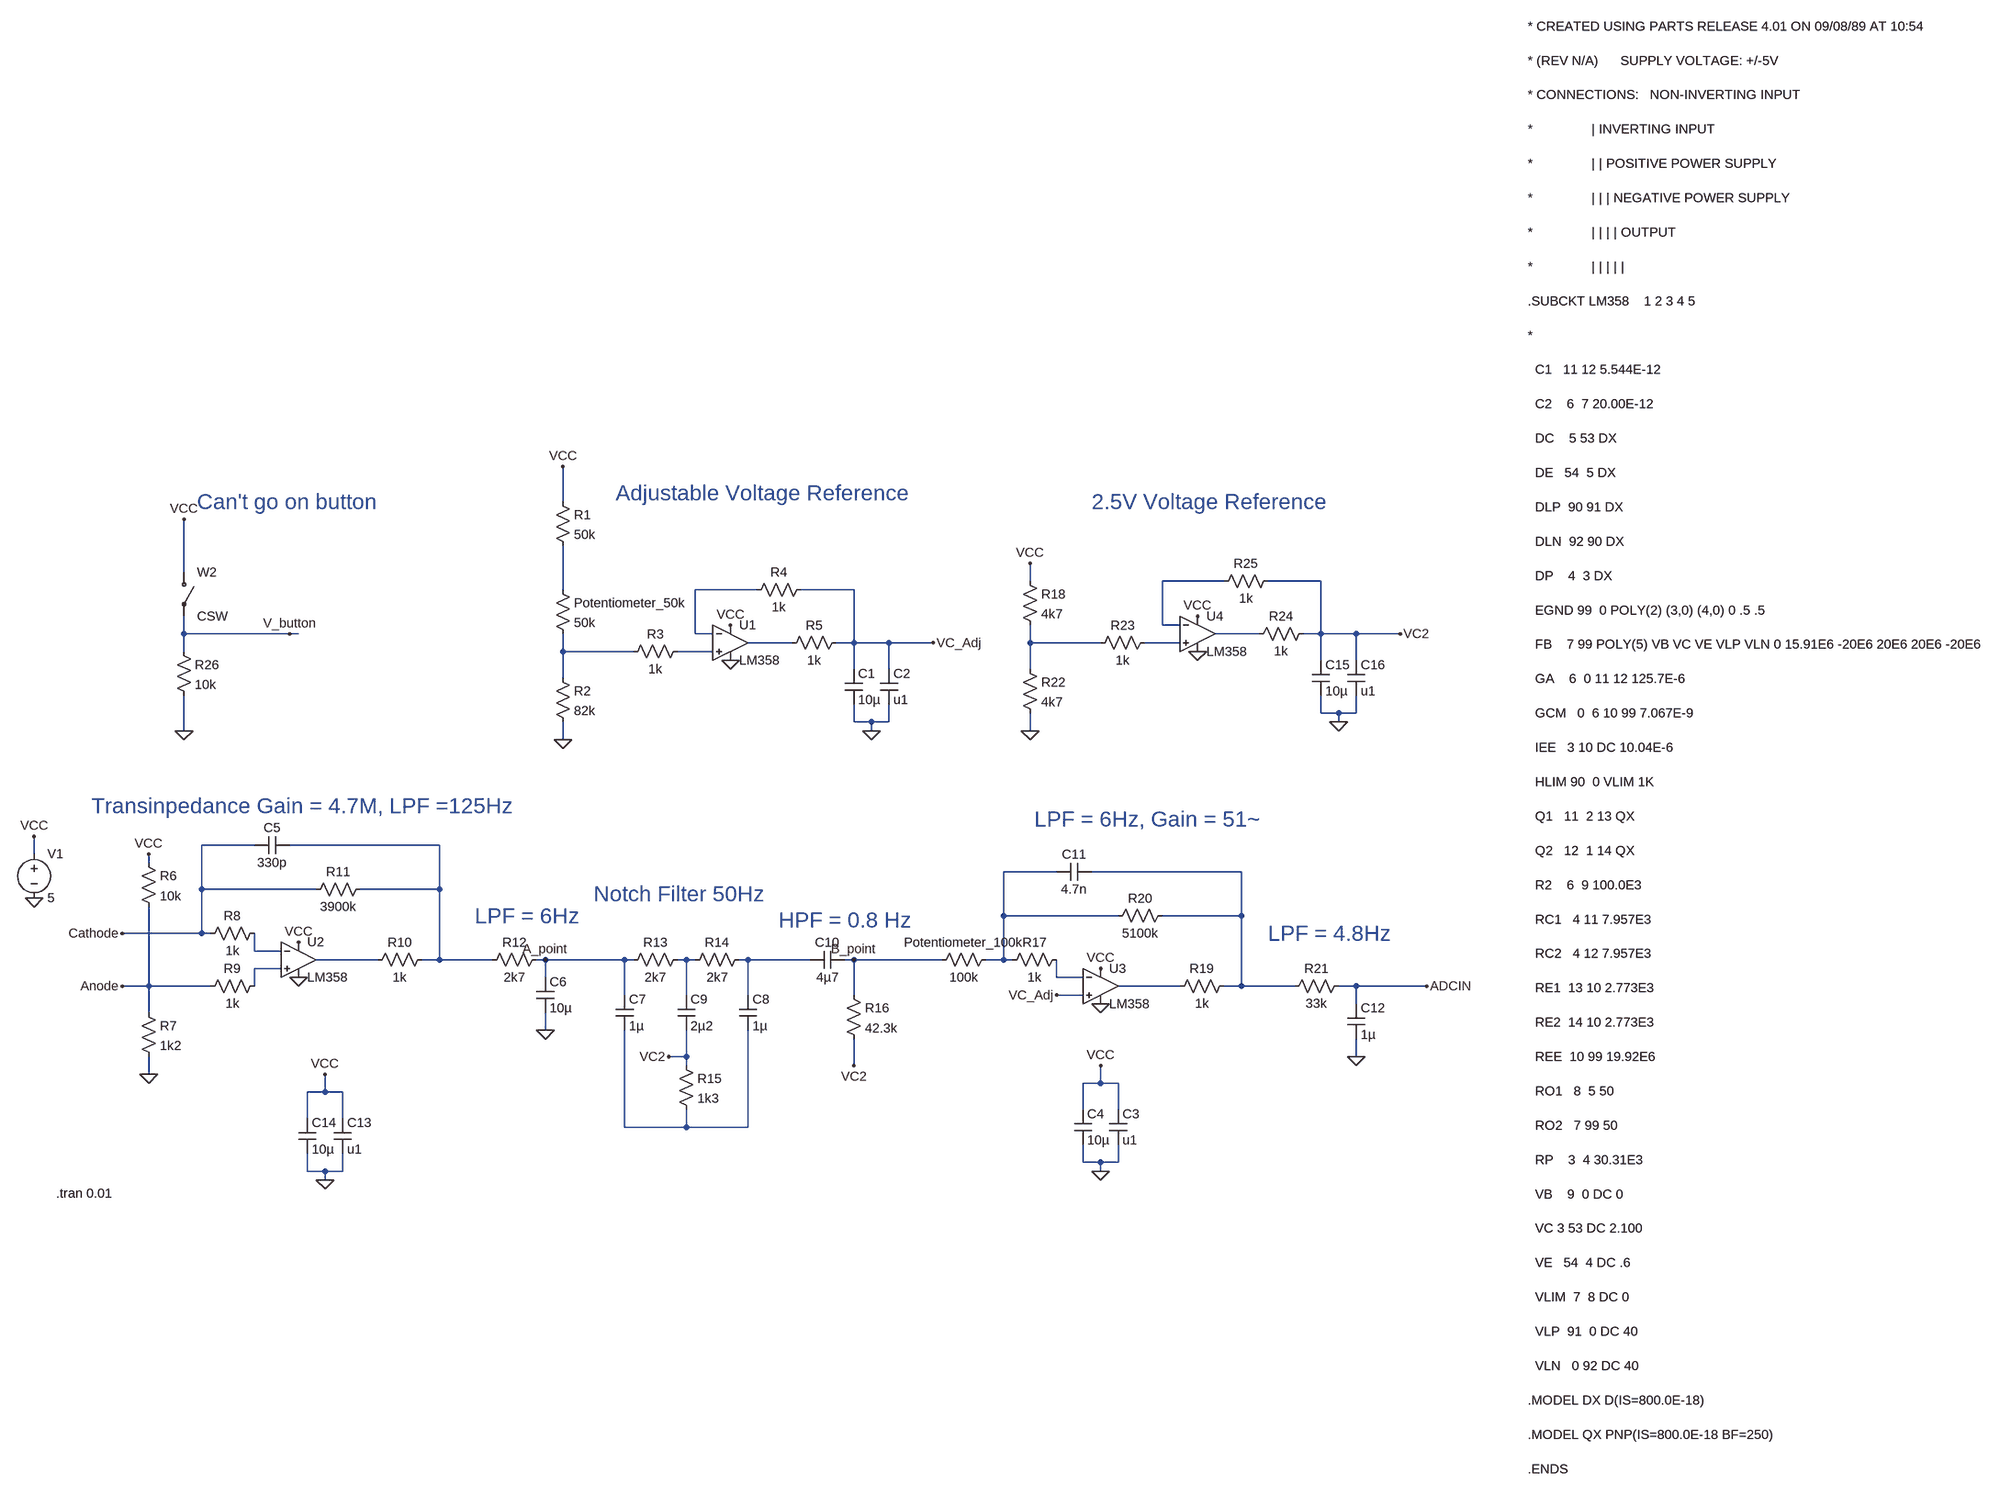
[diagram p0: schematic Analog_Front_End_to_PCB.asc]
Analog_Front_End_to_PCB.asc, the LTspice schematic file:
Version 4
SHEET 1 4952 896
WIRE 1728 -608 1728 -672
WIRE 1040 -480 1040 -576
WIRE 2576 -464 2576 -496
WIRE 2928 -464 2816 -464
WIRE 3104 -464 3008 -464
WIRE 1728 -448 1728 -528
WIRE 2080 -448 1968 -448
WIRE 2256 -448 2160 -448
WIRE 2816 -384 2816 -464
WIRE 2848 -384 2816 -384
WIRE 1040 -368 1040 -400
WIRE 1232 -368 1040 -368
WIRE 1248 -368 1232 -368
WIRE 1968 -368 1968 -448
WIRE 2000 -368 1968 -368
WIRE 2992 -368 2912 -368
WIRE 3104 -368 3104 -464
WIRE 3104 -368 3072 -368
WIRE 3168 -368 3104 -368
WIRE 3248 -368 3168 -368
WIRE 2144 -352 2064 -352
WIRE 2256 -352 2256 -448
WIRE 2256 -352 2224 -352
WIRE 2320 -352 2256 -352
WIRE 2400 -352 2320 -352
WIRE 2576 -352 2576 -384
WIRE 2704 -352 2576 -352
WIRE 2848 -352 2784 -352
WIRE 1040 -336 1040 -368
WIRE 1728 -336 1728 -368
WIRE 1856 -336 1728 -336
WIRE 2000 -336 1936 -336
WIRE 3104 -320 3104 -368
WIRE 3168 -320 3168 -368
WIRE 2256 -304 2256 -352
WIRE 2320 -304 2320 -352
WIRE 2576 -304 2576 -352
WIRE 1728 -288 1728 -336
WIRE 3104 -224 3104 -256
WIRE 3136 -224 3104 -224
WIRE 3168 -224 3168 -256
WIRE 3168 -224 3136 -224
WIRE 2256 -208 2256 -240
WIRE 2288 -208 2256 -208
WIRE 2320 -208 2320 -240
WIRE 2320 -208 2288 -208
WIRE 3136 -208 3136 -224
WIRE 1040 -192 1040 -256
WIRE 2288 -192 2288 -208
WIRE 2576 -192 2576 -224
WIRE 1728 -176 1728 -208
WIRE 1168 16 1072 16
WIRE 1504 16 1232 16
WIRE 768 32 768 0
WIRE 976 48 976 32
WIRE 2624 64 2528 64
WIRE 2960 64 2688 64
WIRE 1072 96 1072 16
WIRE 1280 96 1072 96
WIRE 1504 96 1504 16
WIRE 1504 96 1360 96
WIRE 2528 144 2528 64
WIRE 2736 144 2528 144
WIRE 2960 144 2960 64
WIRE 2960 144 2816 144
WIRE 1072 176 1072 96
WIRE 1072 176 928 176
WIRE 1088 176 1072 176
WIRE 1168 208 1168 176
WIRE 1216 208 1168 208
WIRE 1392 224 1280 224
WIRE 1504 224 1504 96
WIRE 1504 224 1472 224
WIRE 1600 224 1504 224
WIRE 1696 224 1680 224
WIRE 1840 224 1696 224
WIRE 1856 224 1840 224
WIRE 1952 224 1936 224
WIRE 1968 224 1952 224
WIRE 2064 224 2048 224
WIRE 2176 224 2064 224
WIRE 2256 224 2240 224
WIRE 2416 224 2256 224
WIRE 2528 224 2528 144
WIRE 2528 224 2496 224
WIRE 2544 224 2528 224
WIRE 1216 240 1168 240
WIRE 1696 256 1696 224
WIRE 2624 256 2624 224
WIRE 2672 256 2624 256
WIRE 976 272 976 128
WIRE 976 272 928 272
WIRE 1088 272 976 272
WIRE 1168 272 1168 240
WIRE 2848 272 2736 272
WIRE 2960 272 2960 144
WIRE 2960 272 2928 272
WIRE 3056 272 2960 272
WIRE 3168 272 3136 272
WIRE 3296 272 3168 272
WIRE 1840 288 1840 224
WIRE 1952 288 1952 224
WIRE 2064 288 2064 224
WIRE 2256 288 2256 224
WIRE 2672 288 2624 288
WIRE 3168 304 3168 272
WIRE 976 320 976 272
WIRE 1696 352 1696 320
WIRE 1952 400 1952 352
WIRE 1952 400 1920 400
WIRE 3168 400 3168 368
WIRE 1952 416 1952 400
WIRE 2256 416 2256 368
WIRE 976 432 976 400
WIRE 2704 448 2704 416
WIRE 2704 448 2672 448
WIRE 2736 448 2704 448
WIRE 1296 464 1296 432
WIRE 1296 464 1264 464
WIRE 1328 464 1296 464
WIRE 2672 496 2672 448
WIRE 2736 496 2736 448
WIRE 1264 512 1264 464
WIRE 1328 512 1328 464
WIRE 1840 528 1840 352
WIRE 1952 528 1952 496
WIRE 1952 528 1840 528
WIRE 2064 528 2064 352
WIRE 2064 528 1952 528
WIRE 2672 592 2672 560
WIRE 2704 592 2672 592
WIRE 2736 592 2736 560
WIRE 2736 592 2704 592
WIRE 1264 608 1264 576
WIRE 1296 608 1264 608
WIRE 1328 608 1328 576
WIRE 1328 608 1296 608
WIRE 2704 608 2704 592
WIRE 1296 624 1296 608
FLAG 1728 -176 0
FLAG 1728 -672 VCC
FLAG 2288 -192 0
FLAG 2032 -320 0
FLAG 2032 -384 VCC
FLAG 2400 -352 VC_Adj
FLAG 768 112 0
FLAG 768 0 VCC
FLAG 2704 608 0
FLAG 2704 416 VCC
FLAG 976 32 VCC
FLAG 976 432 0
FLAG 928 272 Anode
FLAG 928 176 Cathode
FLAG 1248 256 0
FLAG 1248 192 VCC
FLAG 1696 352 0
FLAG 1920 400 VC2
FLAG 2256 416 VC2
FLAG 2704 304 0
FLAG 2704 240 VCC
FLAG 2624 288 VC_Adj
FLAG 3168 400 0
FLAG 3296 272 ADCIN
FLAG 1296 624 0
FLAG 1296 432 VCC
FLAG 2576 -192 0
FLAG 2576 -496 VCC
FLAG 3136 -208 0
FLAG 2880 -336 0
FLAG 2880 -400 VCC
FLAG 3248 -368 VC2
FLAG 1696 224 A_point
FLAG 2256 224 B_point
FLAG 1040 -192 0
FLAG 1040 -576 VCC
FLAG 1232 -368 V_button
SYMBOL res 1712 -464 R0
SYMATTR InstName Potentiometer_50k
SYMATTR Value 50k
SYMBOL res 1712 -304 R0
SYMATTR InstName R2
SYMATTR Value 82k
SYMBOL res 1952 -352 R90
WINDOW 0 0 56 VBottom 2
WINDOW 3 32 56 VTop 2
SYMATTR InstName R3
SYMATTR Value 1k
SYMBOL Opamps\\opamp2 2032 -416 R0
SYMATTR InstName U1
SYMATTR Value LM358
SYMBOL res 2240 -368 R90
WINDOW 0 0 56 VBottom 2
WINDOW 3 32 56 VTop 2
SYMATTR InstName R5
SYMATTR Value 1k
SYMBOL res 2176 -464 R90
WINDOW 0 0 56 VBottom 2
WINDOW 3 32 56 VTop 2
SYMATTR InstName R4
SYMATTR Value 1k
SYMBOL cap 2240 -304 R0
SYMATTR InstName C1
SYMATTR Value 10µ
SYMBOL cap 2304 -304 R0
SYMATTR InstName C2
SYMATTR Value u1
SYMBOL voltage 768 16 R0
WINDOW 123 0 0 Left 2
WINDOW 39 0 0 Left 2
SYMATTR InstName V1
SYMATTR Value 5
SYMBOL cap 2720 496 R0
SYMATTR InstName C3
SYMATTR Value u1
SYMBOL cap 2656 496 R0
SYMATTR InstName C4
SYMATTR Value 10µ
SYMBOL Opamps\\opamp2 1248 160 R0
SYMATTR InstName U2
SYMATTR Value LM358
SYMBOL res 960 32 R0
SYMATTR InstName R6
SYMATTR Value 10k
SYMBOL res 960 304 R0
SYMATTR InstName R7
SYMATTR Value 1k2
SYMBOL res 1184 160 R90
WINDOW 0 0 56 VBottom 2
WINDOW 3 32 56 VTop 2
SYMATTR InstName R8
SYMATTR Value 1k
SYMBOL res 1184 256 R90
WINDOW 0 0 56 VBottom 2
WINDOW 3 32 56 VTop 2
SYMATTR InstName R9
SYMATTR Value 1k
SYMBOL res 1488 208 R90
WINDOW 0 0 56 VBottom 2
WINDOW 3 32 56 VTop 2
SYMATTR InstName R10
SYMATTR Value 1k
SYMBOL res 1376 80 R90
WINDOW 0 0 56 VBottom 2
WINDOW 3 32 56 VTop 2
SYMATTR InstName R11
SYMATTR Value 3900k
SYMBOL cap 1232 0 R90
WINDOW 0 0 32 VBottom 2
WINDOW 3 32 32 VTop 2
SYMATTR InstName C5
SYMATTR Value 330p
SYMBOL res 1696 208 R90
WINDOW 0 0 56 VBottom 2
WINDOW 3 32 56 VTop 2
SYMATTR InstName R12
SYMATTR Value 2k7
SYMBOL cap 1680 256 R0
SYMATTR InstName C6
SYMATTR Value 10µ
SYMBOL res 1952 208 R90
WINDOW 0 0 56 VBottom 2
WINDOW 3 32 56 VTop 2
SYMATTR InstName R13
SYMATTR Value 2k7
SYMBOL res 2064 208 R90
WINDOW 0 0 56 VBottom 2
WINDOW 3 32 56 VTop 2
SYMATTR InstName R14
SYMATTR Value 2k7
SYMBOL cap 1824 288 R0
SYMATTR InstName C7
SYMATTR Value 1µ
SYMBOL cap 2048 288 R0
SYMATTR InstName C8
SYMATTR Value 1µ
SYMBOL cap 1936 288 R0
SYMATTR InstName C9
SYMATTR Value 2µ2
SYMBOL res 1936 400 R0
SYMATTR InstName R15
SYMATTR Value 1k3
SYMBOL cap 2240 208 R90
WINDOW 0 0 32 VBottom 2
WINDOW 3 32 32 VTop 2
SYMATTR InstName C10
SYMATTR Value 4µ7
SYMBOL res 2240 272 R0
SYMATTR InstName R16
SYMATTR Value 42.3k
SYMBOL Opamps\\opamp2 2704 208 R0
SYMATTR InstName U3
SYMATTR Value LM358
SYMBOL res 2640 208 R90
WINDOW 0 0 56 VBottom 2
WINDOW 3 32 56 VTop 2
SYMATTR InstName R17
SYMATTR Value 1k
SYMBOL res 2944 256 R90
WINDOW 0 0 56 VBottom 2
WINDOW 3 32 56 VTop 2
SYMATTR InstName R19
SYMATTR Value 1k
SYMBOL res 2832 128 R90
WINDOW 0 0 56 VBottom 2
WINDOW 3 32 56 VTop 2
SYMATTR InstName R20
SYMATTR Value 5100k
SYMBOL cap 2688 48 R90
WINDOW 0 0 32 VBottom 2
WINDOW 3 32 32 VTop 2
SYMATTR InstName C11
SYMATTR Value 4.7n
SYMBOL res 2512 208 R90
WINDOW 0 0 56 VBottom 2
WINDOW 3 32 56 VTop 2
SYMATTR InstName Potentiometer_100k
SYMATTR Value 100k
SYMBOL res 3152 256 R90
WINDOW 0 0 56 VBottom 2
WINDOW 3 32 56 VTop 2
SYMATTR InstName R21
SYMATTR Value 33k
SYMBOL cap 3152 304 R0
SYMATTR InstName C12
SYMATTR Value 1µ
SYMBOL cap 1312 512 R0
SYMATTR InstName C13
SYMATTR Value u1
SYMBOL cap 1248 512 R0
SYMATTR InstName C14
SYMATTR Value 10µ
SYMBOL res 2560 -480 R0
SYMATTR InstName R18
SYMATTR Value 4k7
SYMBOL res 2560 -320 R0
SYMATTR InstName R22
SYMATTR Value 4k7
SYMBOL res 2800 -368 R90
WINDOW 0 0 56 VBottom 2
WINDOW 3 32 56 VTop 2
SYMATTR InstName R23
SYMATTR Value 1k
SYMBOL Opamps\\opamp2 2880 -432 R0
SYMATTR InstName U4
SYMATTR Value LM358
SYMBOL res 3088 -384 R90
WINDOW 0 0 56 VBottom 2
WINDOW 3 32 56 VTop 2
SYMATTR InstName R24
SYMATTR Value 1k
SYMBOL res 3024 -480 R90
WINDOW 0 0 56 VBottom 2
WINDOW 3 32 56 VTop 2
SYMATTR InstName R25
SYMATTR Value 1k
SYMBOL cap 3088 -320 R0
SYMATTR InstName C15
SYMATTR Value 10µ
SYMBOL cap 3152 -320 R0
SYMATTR InstName C16
SYMATTR Value u1
SYMBOL res 1712 -624 R0
SYMATTR InstName R1
SYMATTR Value 50k
SYMBOL res 1024 -352 R0
SYMATTR InstName R26
SYMATTR Value 10k
SYMBOL csw 1040 -480 R0
SYMATTR InstName W2
TEXT 808 648 Left 2 !.tran 0.01
TEXT 2688 -608 Left 4 ;2.5V Voltage Reference
TEXT 1824 -624 Left 4 ;Adjustable Voltage Reference
TEXT 872 -56 Left 4 ;Transinpedance Gain = 4.7M, LPF =125Hz
TEXT 1784 104 Left 4 ;Notch Filter 50Hz
TEXT 2120 152 Left 4 ;HPF = 0.8 Hz
TEXT 2584 -32 Left 4 ;LPF = 6Hz, Gain = 51~
TEXT 3008 176 Left 4 ;LPF = 4.8Hz
TEXT 1568 144 Left 4 ;LPF = 6Hz
TEXT 1064 -608 Left 4 ;Can't go on button
TEXT 4016 -1472 Left 2 !* CREATED USING PARTS RELEASE 4.01 ON 09/08/89 AT 10:54\n \n* (REV N/A)      SUPPLY VOLTAGE: +/-5V\n \n* CONNECTIONS:   NON-INVERTING INPUT\n \n*                | INVERTING INPUT\n \n*                | | POSITIVE POWER SUPPLY\n \n*                | | | NEGATIVE POWER SUPPLY\n \n*                | | | | OUTPUT\n \n*                | | | | |\n \n.SUBCKT LM358    1 2 3 4 5\n \n*\n \n  C1   11 12 5.544E-12\n \n  C2    6  7 20.00E-12\n \n  DC    5 53 DX\n \n  DE   54  5 DX\n \n  DLP  90 91 DX\n \n  DLN  92 90 DX\n \n  DP    4  3 DX\n \n  EGND 99  0 POLY(2) (3,0) (4,0) 0 .5 .5\n \n  FB    7 99 POLY(5) VB VC VE VLP VLN 0 15.91E6 -20E6 20E6 20E6 -20E6\n \n  GA    6  0 11 12 125.7E-6\n \n  GCM   0  6 10 99 7.067E-9\n \n  IEE   3 10 DC 10.04E-6\n \n  HLIM 90  0 VLIM 1K\n \n  Q1   11  2 13 QX\n \n  Q2   12  1 14 QX\n \n  R2    6  9 100.0E3\n \n  RC1   4 11 7.957E3\n \n  RC2   4 12 7.957E3\n \n  RE1  13 10 2.773E3\n \n  RE2  14 10 2.773E3\n \n  REE  10 99 19.92E6\n \n  RO1   8  5 50\n \n  RO2   7 99 50\n \n  RP    3  4 30.31E3\n \n  VB    9  0 DC 0\n \n  VC 3 53 DC 2.100\n \n  VE   54  4 DC .6\n \n  VLIM  7  8 DC 0\n \n  VLP  91  0 DC 40\n \n  VLN   0 92 DC 40\n \n.MODEL DX D(IS=800.0E-18)\n \n.MODEL QX PNP(IS=800.0E-18 BF=250)\n \n.ENDS

The netlist it stands for:
* Analog_Front_End_to_PCB.asc
R§Potentiometer_50k N002 N008 50k
R2 N008 0 82k
R3 N009 N008 1k
XU1 N009 N003 VCC 0 N005 LM358  ; pins In+ In- V+ V- OUT
R5 VC_Adj N005 1k
R4 VC_Adj N003 1k
C1 VC_Adj 0 10µ
C2 VC_Adj 0 u1
V1 VCC 0 5
C3 VCC 0 u1
C4 VCC 0 10µ
XU2 N017 N013 VCC 0 N014 LM358  ; pins In+ In- V+ V- OUT
R6 VCC Anode 10k
R7 Anode 0 1k2
R8 N013 Cathode 1k
R9 N017 Anode 1k
R10 N010 N014 1k
R11 N010 Cathode 3900k
C5 N010 Cathode 330p
R12 A_point N010 2k7
C6 A_point 0 10µ
R13 N015 A_point 2k7
R14 N016 N015 2k7
C7 A_point N020 1µ
C8 N016 N020 1µ
C9 N015 VC2 2µ2
R15 VC2 N020 1k3
C10 B_point N016 4µ7
R16 B_point VC2 42.3k
XU3 VC_Adj N018 VCC 0 N019 LM358  ; pins In+ In- V+ V- OUT
R17 N018 N011 1k
R19 N012 N019 1k
R20 N012 N011 5100k
C11 N012 N011 4.7n
R§Potentiometer_100k N011 B_point 100k
R21 ADCIN N012 33k
C12 ADCIN 0 1µ
C13 VCC 0 u1
C14 VCC 0 10µ
R18 VCC N006 4k7
R22 N006 0 4k7
R23 N007 N006 1k
XU4 N007 N001 VCC 0 N004 LM358  ; pins In+ In- V+ V- OUT
R24 VC2 N004 1k
R25 VC2 N001 1k
C15 VC2 0 10µ
C16 VC2 0 u1
R1 VCC N002 50k
R26 V_button 0 10k
W2 VCC V_button CSW
.tran 0.01
* 2.5V Voltage Reference
* Adjustable Voltage Reference
* Transinpedance Gain = 4.7M, LPF =125Hz
* Notch Filter 50Hz
* HPF = 0.8 Hz
* LPF = 6Hz, Gain = 51~
* LPF = 4.8Hz
* LPF = 6Hz
* Can't go on button
* CREATED USING PARTS RELEASE 4.01 ON 09/08/89 AT 10:54
* (REV N/A)      SUPPLY VOLTAGE: +/-5V
* CONNECTIONS:   NON-INVERTING INPUT
*                | INVERTING INPUT
*                | | POSITIVE POWER SUPPLY
*                | | | NEGATIVE POWER SUPPLY
*                | | | | OUTPUT
*                | | | | |
.SUBCKT LM358    1 2 3 4 5
*
  C1   11 12 5.544E-12
  C2    6  7 20.00E-12
  DC    5 53 DX
  DE   54  5 DX
  DLP  90 91 DX
  DLN  92 90 DX
  DP    4  3 DX
  EGND 99  0 POLY(2) (3,0) (4,0) 0 .5 .5
  FB    7 99 POLY(5) VB VC VE VLP VLN 0 15.91E6 -20E6 20E6 20E6 -20E6
  GA    6  0 11 12 125.7E-6
  GCM   0  6 10 99 7.067E-9
  IEE   3 10 DC 10.04E-6
  HLIM 90  0 VLIM 1K
  Q1   11  2 13 QX
  Q2   12  1 14 QX
  R2    6  9 100.0E3
  RC1   4 11 7.957E3
  RC2   4 12 7.957E3
  RE1  13 10 2.773E3
  RE2  14 10 2.773E3
  REE  10 99 19.92E6
  RO1   8  5 50
  RO2   7 99 50
  RP    3  4 30.31E3
  VB    9  0 DC 0
  VC 3 53 DC 2.100
  VE   54  4 DC .6
  VLIM  7  8 DC 0
  VLP  91  0 DC 40
  VLN   0 92 DC 40
.MODEL DX D(IS=800.0E-18)
.MODEL QX PNP(IS=800.0E-18 BF=250)
.ENDS
.backanno
.end